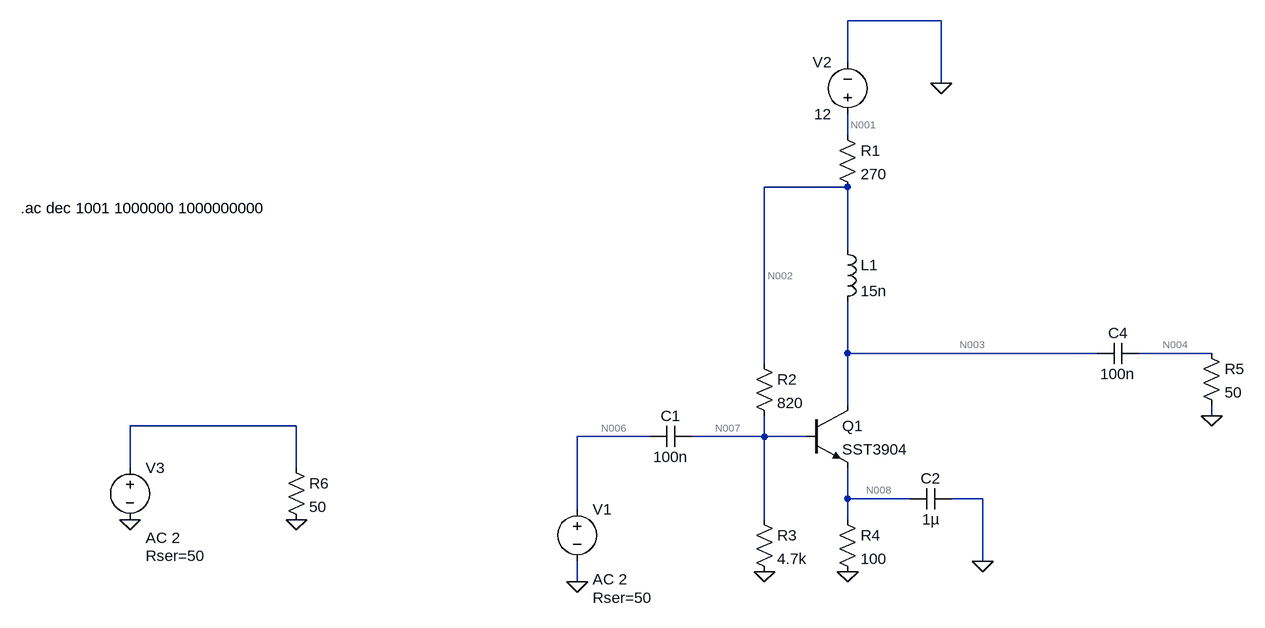
[diagram p0: schematic rf_power_amplifer.asc]
rf_power_amplifer.asc, the LTspice schematic file:
Version 4
SHEET 1 1128 680
WIRE 240 -384 96 -384
WIRE 96 -320 96 -384
WIRE 240 -288 240 -384
WIRE 96 -208 96 -240
WIRE 96 -128 -32 -128
WIRE 96 -32 96 -128
WIRE 96 128 96 48
WIRE 480 128 96 128
WIRE 656 128 544 128
WIRE -32 144 -32 -128
WIRE 96 208 96 128
WIRE 656 224 656 208
WIRE -752 240 -1008 240
WIRE -208 256 -320 256
WIRE -32 256 -32 224
WIRE -32 256 -144 256
WIRE 32 256 -32 256
WIRE -1008 304 -1008 240
WIRE -752 304 -752 240
WIRE 96 352 96 304
WIRE 192 352 96 352
WIRE 304 352 256 352
WIRE -320 368 -320 256
WIRE -32 384 -32 256
WIRE 96 384 96 352
WIRE 304 448 304 352
WIRE -320 480 -320 448
FLAG -1008 384 0
FLAG -752 384 0
FLAG 656 224 0
FLAG 96 464 0
FLAG -32 464 0
FLAG 304 448 0
FLAG -320 480 0
FLAG 240 -288 0
SYMBOL voltage -1008 288 R0
WINDOW 123 24 124 Left 2
WINDOW 39 24 152 Left 2
SYMATTR Value2 AC 2
SYMATTR SpiceLine Rser=50
SYMATTR InstName V3
SYMATTR Value ""
SYMBOL res -768 288 R0
SYMATTR InstName R6
SYMATTR Value 50
SYMBOL npn 32 208 R0
SYMATTR InstName Q1
SYMATTR Value SST3904
SYMBOL res 80 -224 R0
SYMATTR InstName R1
SYMATTR Value 270
SYMBOL res -48 128 R0
SYMATTR InstName R2
SYMATTR Value 820
SYMBOL res -48 368 R0
SYMATTR InstName R3
SYMATTR Value 4.7k
SYMBOL res 80 368 R0
SYMATTR InstName R4
SYMATTR Value 100
SYMBOL voltage -320 352 R0
WINDOW 123 24 124 Left 2
WINDOW 39 24 152 Left 2
SYMATTR Value2 AC 2
SYMATTR SpiceLine Rser=50
SYMATTR InstName V1
SYMATTR Value ""
SYMBOL cap -144 240 R90
WINDOW 0 0 32 VBottom 2
WINDOW 3 32 32 VTop 2
SYMATTR InstName C1
SYMATTR Value 100n
SYMBOL cap 256 336 R90
WINDOW 0 0 32 VBottom 2
WINDOW 3 32 32 VTop 2
SYMATTR InstName C2
SYMATTR Value 1µ
SYMBOL res 640 112 R0
SYMATTR InstName R5
SYMATTR Value 50
SYMBOL voltage 96 -224 R180
WINDOW 0 24 96 Left 2
WINDOW 3 24 16 Left 2
WINDOW 123 0 0 Left 0
WINDOW 39 0 0 Left 0
SYMATTR InstName V2
SYMATTR Value 12
SYMBOL cap 544 112 R90
WINDOW 0 0 32 VBottom 2
WINDOW 3 32 32 VTop 2
SYMATTR InstName C4
SYMATTR Value 100n
SYMBOL ind 80 -48 R0
SYMATTR InstName L1
SYMATTR Value 15n
TEXT -1176 -96 Left 2 !.ac dec 1001 1000000 1000000000

The netlist it stands for:
* rf_power_amplifer.asc
V3 N005 0 AC 2 Rser=50
R6 N005 0 50
Q1 N003 N007 N008 0 SST3904
R1 N001 N002 270
R2 N002 N007 820
R3 N007 0 4.7k
R4 N008 0 100
V1 N006 0 AC 2 Rser=50
C1 N007 N006 100n
C2 0 N008 1µ
R5 N004 0 50
V2 N001 0 12
C4 N004 N003 100n
L1 N002 N003 15n
.model NPN NPN
.model PNP PNP
.lib standard.bjt
.ac dec 1001 1000000 1000000000
.backanno
.end

* Results of the author's LTspice run, read from the files saved beside the schematic
* Operating Point, zero values left out:
*   V(n003) = 4.29 V
*   V(n007) = 3.54 V
*   V(n008) = 2.78 V
*   V(n001) = 12 V
*   V(n002) = 4.29 V
*   Ic(Q1) = 27.64 mA
*   Ib(Q1) = 161.1 µA
*   Ie(Q1) = -27.8 mA
*   I(L1) = 27.64 mA
*   I(R4) = 27.8 mA
*   I(R3) = 753.2 µA
*   I(R2) = 914.3 µA
*   I(R1) = 28.56 mA
*   I(V2) = -28.56 mA
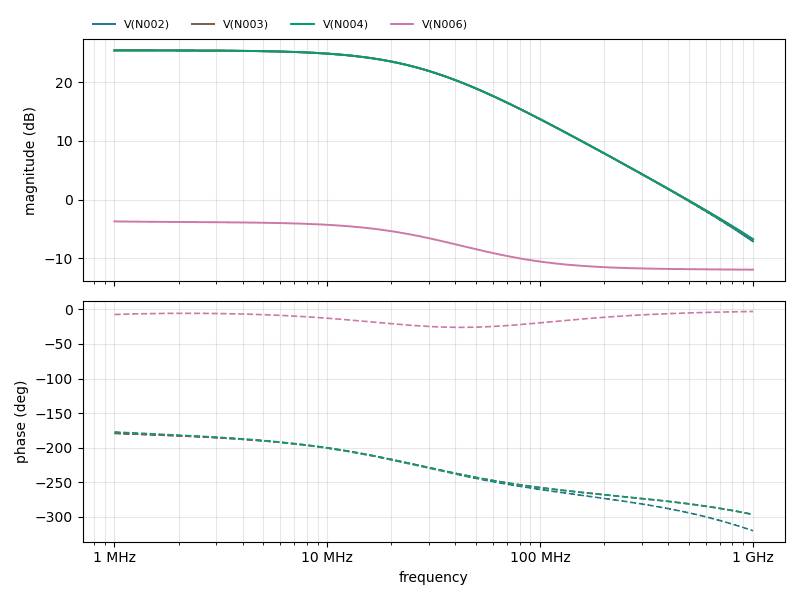
[diagram p1: AC Analysis of rf_power_amplifer.asc, plotted from the saved traces]
* AC Analysis, 1 run:
*   V(N002): 25.43 dB at 1 MHz, -7.12 dB at 1 GHz, peak 25.44 dB at 1.309 MHz, 3 dB below the peak at 26.91 MHz
*   V(N003): 25.43 dB at 1 MHz, -6.77 dB at 1 GHz, peak 25.44 dB at 1.309 MHz, 3 dB below the peak at 26.91 MHz
*   V(N004): 25.43 dB at 1 MHz, -6.77 dB at 1 GHz, peak 25.43 dB at 1.383 MHz, 3 dB below the peak at 26.93 MHz
*   V(N006): -3.72 dB at 1 MHz, -11.94 dB at 1 GHz, peak -3.72 dB at 1 MHz, 3 dB below the peak at 31.31 MHz